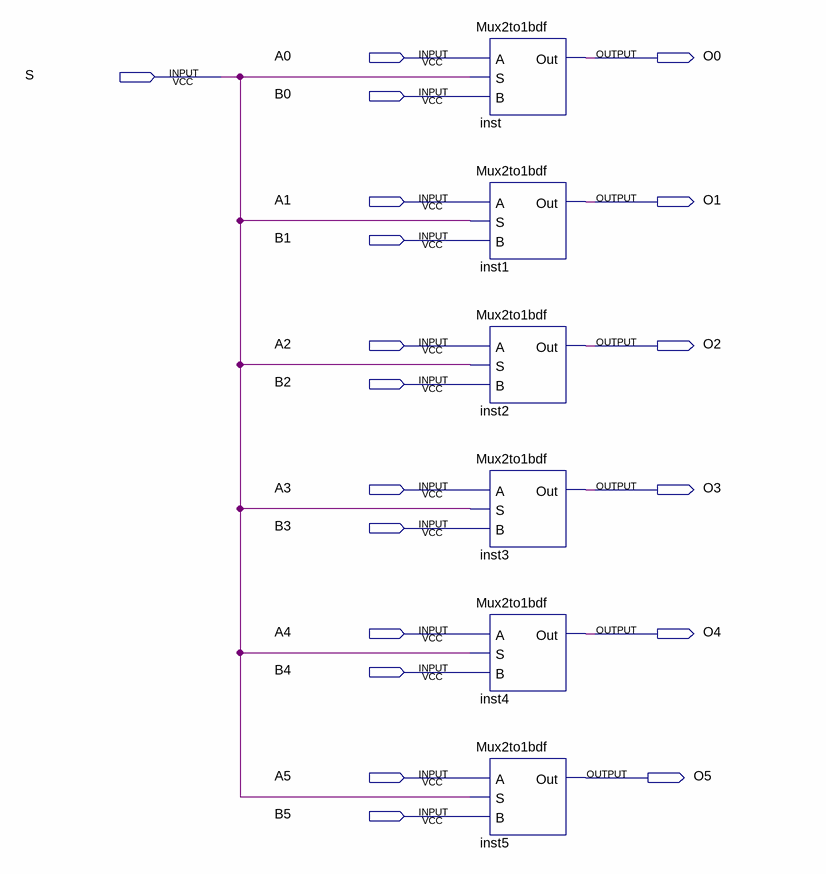
[diagram p0: schematic sheet]
// Quartus schematic Mux2to1_6bit.bdf as structural Verilog: 6 symbols, 19 pins
module Mux2to1_6bit (
  input  A0,
  input  S,
  input  B0,
  input  A1,
  input  B1,
  input  A2,
  input  B2,
  input  A3,
  input  B3,
  input  A4,
  input  B4,
  input  A5,
  input  B5,
  output O0,
  output O1,
  output O2,
  output O3,
  output O4,
  output O5
);

  Mux2to1bdf inst (.A(A0), .S(S), .B(B0), .Out(O0));
  Mux2to1bdf inst1 (.A(A1), .S(S), .B(B1), .Out(O1));
  Mux2to1bdf inst2 (.A(A2), .S(S), .B(B2), .Out(O2));
  Mux2to1bdf inst3 (.A(A3), .S(S), .B(B3), .Out(O3));
  Mux2to1bdf inst4 (.A(A4), .S(S), .B(B4), .Out(O4));
  Mux2to1bdf inst5 (.A(A5), .S(S), .B(B5), .Out(O5));
endmodule
